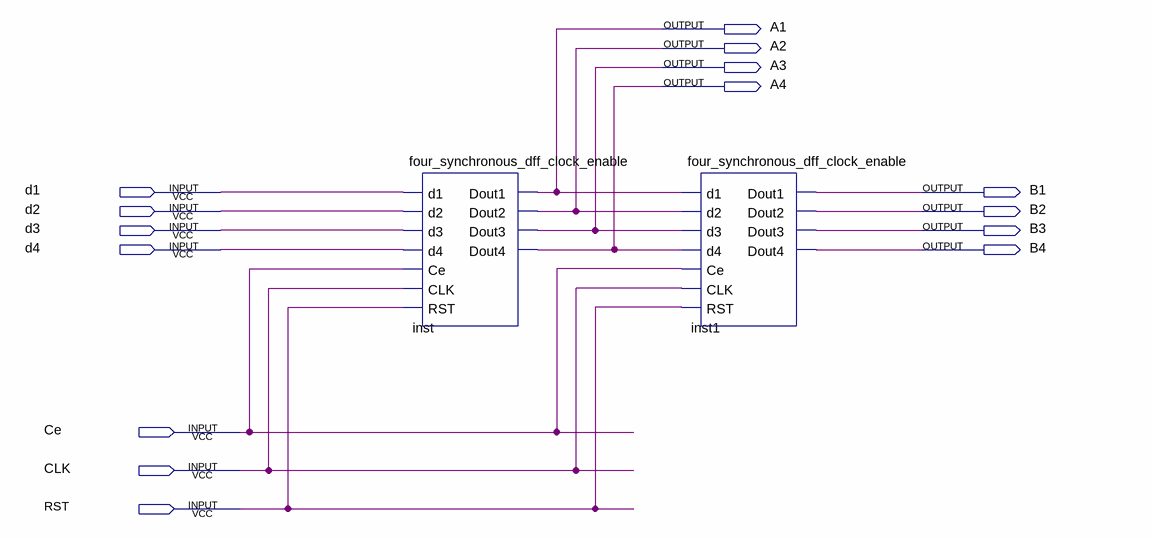
[diagram p0: schematic sheet]
// Quartus schematic double_four_bit_register.bdf as structural Verilog: 2 symbols, 15 pins
module double_four_bit_register (
  input  d1,
  input  d2,
  input  d3,
  input  d4,
  input  Ce,
  input  CLK,
  input  RST,
  output A1,
  output A2,
  output A3,
  output A4,
  output B1,
  output B2,
  output B3,
  output B4
);

  four_synchronous_dff_clock_enable inst (
    .d1(d1), .d2(d2), .d3(d3), .d4(d4), .Ce(Ce), .CLK(CLK), .RST(RST), .Dout1(A1), .Dout2(A2), .Dout3(A3),
    .Dout4(A4));
  four_synchronous_dff_clock_enable inst1 (
    .d1(A1), .d2(A2), .d3(A3), .d4(A4), .Ce(Ce), .CLK(CLK), .RST(RST), .Dout1(B1), .Dout2(B2), .Dout3(B3),
    .Dout4(B4));
endmodule
